# EAGLE design high_pass_hv (EAGLE 6.6.0)
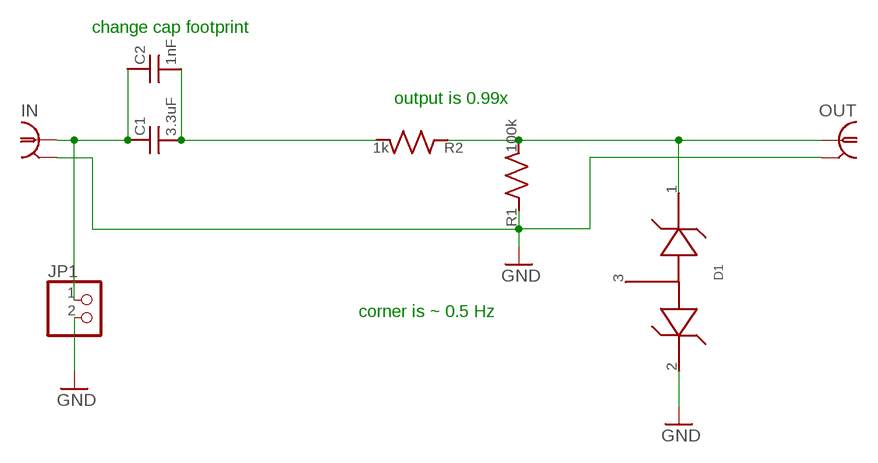
[diagram p0: schematic, sheet 1]

## Parts
C1  3.3uF  C_MLCC_SMDCMLCC_JLEAD  [CKG-JLEAD]
C2  1nF  C_MLCC_SMDCMLCC_1206  [C_MLCC_1206]
D1  ZENER-DUAL  [SOT-23]
IN  BNC-H  [BNC90]
JP1  SCRWTRM-1X2/90_ED550  [1X02_RA_SCRWTRM_ED550]
OUT  BNC-H  [BNC90]
R1  100k  R_SMDR1206  [R_1206]
R2  1k  R_SMDR1206  [R_1206]

## Nets
GND: D1.2 IN.2 JP1.2 OUT.2 R1.P$1
N$1: C1.P$1 C2.P$1 IN.1 JP1.1
N$2: C1.P$2 C2.P$2 R2.P$2
N$3: D1.1 OUT.1 R1.P$2 R2.P$1
Unconnected: D1.3

## Notes on the sheet
- change cap footprint
- output is 0.99x
- corner is ~ 0.5 Hz

## Library data of the parts
C1 C2 = jqi_passives:C_MLCC_SMD
D1 = semiconductor-jqi:ZENER-DUAL
IN OUT = connector-jqi:BNC: BNC Connector.; DIGIKEY: A32260-ND
JP1 = Lin-Temp-Controller:SCRWTRM-1X2: Screw Terminal; DIGIKEY: ED1501-ND; MFR_PN: ED550/2DS
R1 R2 = jqi_passives:R_SMD

## Board
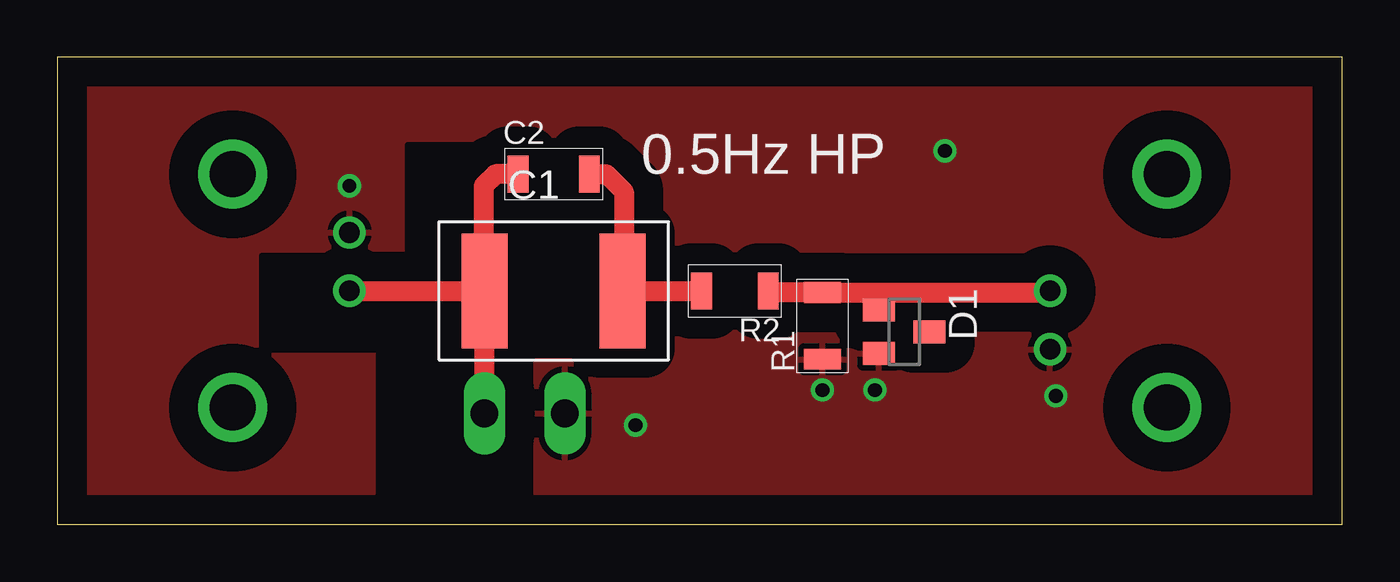
[diagram p1: board, top side]
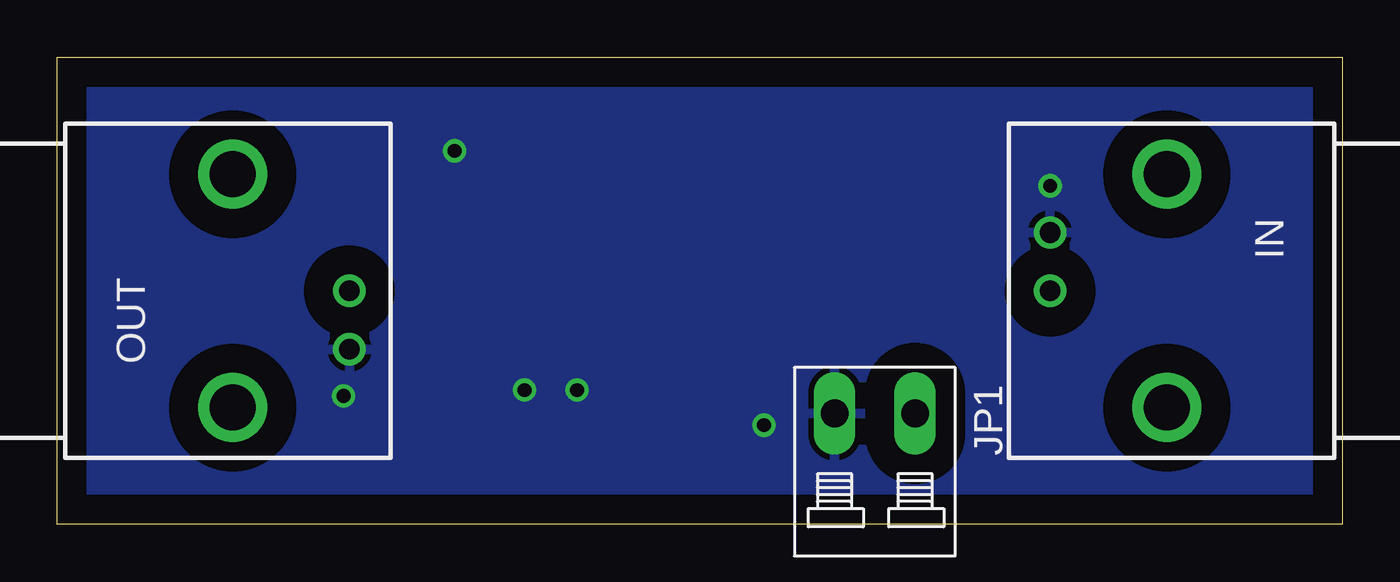
[diagram p2: board, bottom side, seen from below]

Size 55.88 x 20.32 mm. Coordinates in mm from the lower left corner, seen from the top.
Outline: 0,20.32 0,0 55.88,0 55.88,20.32 0,20.32
Copper layers (1*16): Top 0.035mm / dielectric 1.5mm / Bottom 0.035mm
Design rules "default": minimum track width 10mil, minimum drill 24mil, track to track 8mil, track to pad 8mil, pad to pad 8mil, via to via 8mil, smd to smd 8mil, copper to edge 40mil, drill to drill 8mil, minimum pad ring 10mil, minimum via ring 8mil, stop-mask expansion 4mil, vias tented up to drill 0mil, thermal gap 10mil

### Footprints (pad centres in the part's own frame; a part is rotated, then mirrored left to right if it is on the bottom)
CKG-JLEAD = smd 2 x 5: P$1 -3,0; P$2 3,0
C_MLCC_1206 = smd 0.9 x 1.6: P$1 -1.55,0; P$2 1.55,0
SOT-23 = smd 1 x 1.4: 1 -0.95,-1.1; 2 0.95,-1.1; 3 0,1.1
BNC90 = drill 0.9 pad 1.27: 1 0,-5.08; 2 -2.54,-5.08 | drill 2 pad 2.032: ANCHOR1 -5.08,0; ANCHOR2 5.08,0
1X02_RA_SCRWTRM_ED550 = drill 1.2 long: 1 -1.75,0; 2 1.75,0
R_1206 = smd 0.9 x 1.6: P$1 -1.45,0; P$2 1.45,0

### Placement (x,y rotation side)
C1  21.59,10.16 0 top
C2  21.59,15.24 0 top
D1  36.83,8.38 270 top
IN  7.62,10.16 270 bottom
JP1  20.32,4.83 180 bottom
OUT  48.26,10.16 90 bottom
R1  33.27,8.64 90 top
R2  29.46,10.16 180 top

### Tracks (layer width: path | path; a pad name or v marks a point on that pad's centre or on a via)
GND  (via drill 0.6)
  other vias: 25.15,4.32 33.27,5.84 35.56,5.84 43.43,5.59 38.61,16.26 12.7,14.73
  pour Top (isolate 1.27): 0,20.32 55.88,20.32 55.88,0 0,0
  pour Bottom (isolate 1.27): 0,20.32 55.88,20.32 55.88,0 0,0
N$1
  Top 0.864: IN.1 C1.P$1 | C2.P$1 19.05,15.24 18.54,14.73 18.54,10.21 C1.P$1 | JP1.1 18.57,10.14 C1.P$1
N$2
  Top 0.864: R2.P$2 C1.P$2 24.64,10.21 24.64,14.48 23.88,15.24 C2.P$2
N$3
  Top 0.864: R2.P$1 30.99,10.09 R1.P$2 35.56,10.09 | 35.56,10.09 43.11,10.09 OUT.1 | D1.1 35.73,9.92 35.56,10.09
N$4
  cutout Top: 15.24,11.68 8.89,11.68 8.89,7.62 13.97,7.62 13.97,1.27 20.57,1.27 20.57,7.37 23.11,7.37 23.11,16.51 15.24,16.51

### Text on the board
tPlace: 0.5Hz HP